# Altium schematic sheet schema2.SchDoc
size A3; DrawnBy: CdB; Engineer: CdB; Organization: Ultimaker B.V.; DocumentNumber: 2; Revision: 1548-I; SheetNumber: 2; SheetTotal: 6; PageSetup: Record=PageOptions|CenterHorizontal=True|CenterVertical=True|PrintScale=1.01|XCorrection=1.00|YCorrection=1.00|PrintKind=1|BorderSize=5000000|LeftOffset=0|BottomOffset=0|Orientation=2|PaperLength=1000|PaperWidth=1000|Scale=100|PaperSource=7|PrintQuality=1200|MediaType=1|DitherType=10|PaperKind=A3 (297 x 420mm)|PrintScaleMode=1
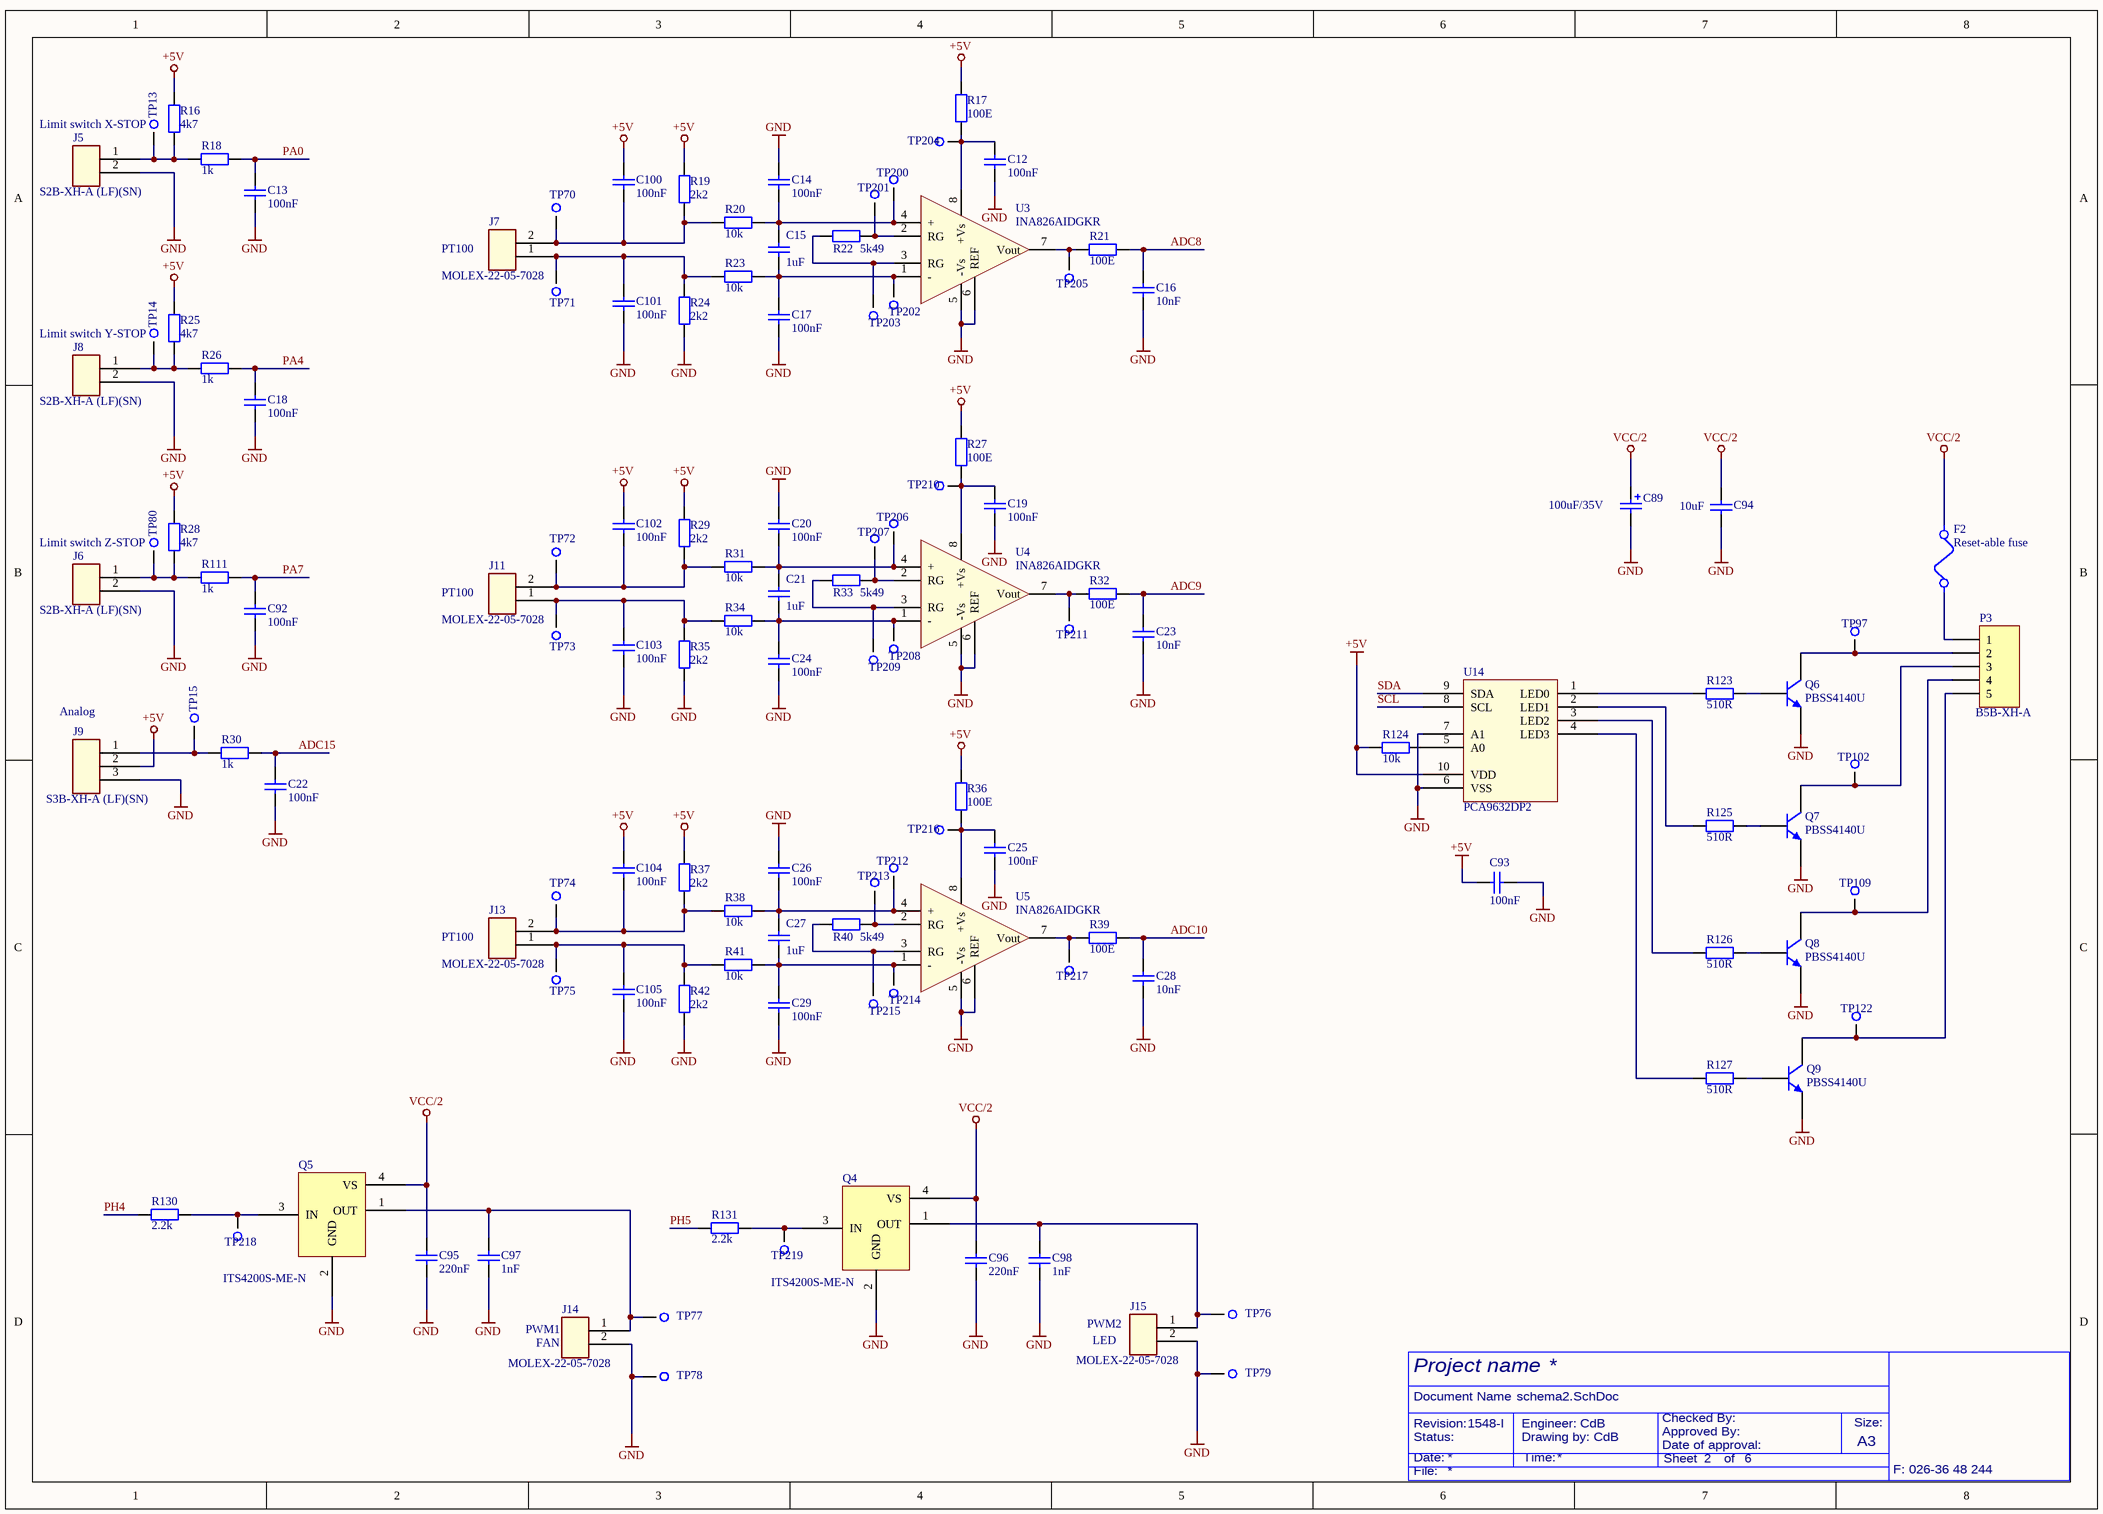
[diagram p0: schema2.SchDoc]

## Parts
C12  100nF  [C0603]
C13  100nF  [C0603]
C14  100nF  [C0603]
C15  1uF  [C0603]
C16  10nF  [C0603]
C17  100nF  [C0603]
C18  100nF  [C0603]
C19  100nF  [C0603]
C20  100nF  [C0603]
C21  1uF  [C0603]
C22  100nF  [C0603]
C23  10nF  [C0603]
C24  100nF  [C0603]
C25  100nF  [C0603]
C26  100nF  [C0603]
C27  1uF  [C0603]
C28  10nF  [C0603]
C29  100nF  [C0603]
C89  100uF/35V  [ELCO Case D]
C92  100nF  [C0603]
C93  100nF  [C0805]
C94  10uF  [C1206]
C95  220nF  [C0805]
C96  220nF  [C0805]
C97  1nF  [C0603]
C98  1nF  [C0603]
C100  100nF  [C0603]
C101  100nF  [C0603]
C102  100nF  [C0603]
C103  100nF  [C0603]
C104  100nF  [C0603]
C105  100nF  [C0603]
F2  Reset-able fuse  [Bourns reset-able fuse]
J5  S2B-XH-A (LF)(SN)  [S2B-XH-A (LF)(SN)]
J6  S2B-XH-A (LF)(SN)  [S2B-XH-A (LF)(SN)]
J7  MOLEX-22-05-7028  [MOLEX-22-05-7028]
J8  S2B-XH-A (LF)(SN)  [S2B-XH-A (LF)(SN)]
J9  S3B-XH-A (LF)(SN)  [S3B-XH-A (LF)(SN)]
J11  MOLEX-22-05-7028  [MOLEX-22-05-7028]
J13  MOLEX-22-05-7028  [MOLEX-22-05-7028]
J14  MOLEX-22-05-7028  [MOLEX-22-05-7028]
J15  MOLEX-22-05-7028  [MOLEX-22-05-7028]
P3  B5B-XH-A  [B5B-XH-A]
Q4  ITS4200S-ME-N  [SOT223 Smartfet]
Q5  ITS4200S-ME-N  [SOT223 Smartfet]
Q6  PBSS4140U  [SOT65P210X110-3N]
Q7  PBSS4140U  [SOT65P210X110-3N]
Q8  PBSS4140U  [SOT65P210X110-3N]
Q9  PBSS4140U  [SOT65P210X110-3N]
R16  4k7  [R0603]
R17  100E  [R0603]
R18  1k  [R0603]
R19  2k2  [R0603]
R20  10k  [R0603]
R21  100E  [R0603]
R22  5k49  [R0603]
R23  10k  [R0603]
R24  2k2  [R0603]
R25  4k7  [R0603]
R26  1k  [R0603]
R27  100E  [R0603]
R28  4k7  [R0603]
R29  2k2  [R0603]
R30  1k  [R0603]
R31  10k  [R0603]
R32  100E  [R0603]
R33  5k49  [R0603]
R34  10k  [R0603]
R35  2k2  [R0603]
R36  100E  [R0603]
R37  2k2  [R0603]
R38  10k  [R0603]
R39  100E  [R0603]
R40  5k49  [R0603]
R41  10k  [R0603]
R42  2k2  [R0603]
R111  1k  [R0603]
R123  510R  [R0603]
R124  10k  [R0603]
R125  510R  [R0603]
R126  510R  [R0603]
R127  510R  [R0603]
R130  2.2k  [RESC1608X05N]
R131  2.2k  [RESC1608X05N]
TP13  Testpoint  [Testpoint]  (value not drawn)
TP14  Testpoint  [Testpoint]  (value not drawn)
TP15  Testpoint  [Testpoint]  (value not drawn)
TP70  Testpoint  [Testpoint]  (value not drawn)
TP71  Testpoint  [Testpoint]  (value not drawn)
TP72  Testpoint  [Testpoint]  (value not drawn)
TP73  Testpoint  [Testpoint]  (value not drawn)
TP74  Testpoint  [Testpoint]  (value not drawn)
TP75  Testpoint  [Testpoint]  (value not drawn)
TP76  Testpoint  [Testpoint]  (value not drawn)
TP77  Testpoint  [Testpoint]  (value not drawn)
TP78  Testpoint  [Testpoint]  (value not drawn)
TP79  Testpoint  [Testpoint]  (value not drawn)
TP80  Testpoint  [Testpoint]  (value not drawn)
TP97  2mm  [TESTPOINT]  (value not drawn)  (no BOM)
TP102  2mm  [TESTPOINT]  (value not drawn)  (no BOM)
TP109  2mm  [TESTPOINT]  (value not drawn)  (no BOM)
TP122  2mm  [TESTPOINT]  (value not drawn)  (no BOM)
TP200  Testpoint 1.6mm  [Testpoint 1.6mm]  (value not drawn)
TP201  Testpoint 1.6mm  [Testpoint 1.6mm]  (value not drawn)
TP202  Testpoint 1.6mm  [Testpoint 1.6mm]  (value not drawn)
TP203  Testpoint 1.6mm  [Testpoint 1.6mm]  (value not drawn)
TP204  Testpoint 1.6mm  [Testpoint 1.6mm]  (value not drawn)
TP205  Testpoint 1.6mm  [Testpoint 1.6mm]  (value not drawn)
TP206  Testpoint 1.6mm  [Testpoint 1.6mm]  (value not drawn)
TP207  Testpoint 1.6mm  [Testpoint 1.6mm]  (value not drawn)
TP208  Testpoint 1.6mm  [Testpoint 1.6mm]  (value not drawn)
TP209  Testpoint 1.6mm  [Testpoint 1.6mm]  (value not drawn)
TP210  Testpoint 1.6mm  [Testpoint 1.6mm]  (value not drawn)
TP211  Testpoint 1.6mm  [Testpoint 1.6mm]  (value not drawn)
TP212  Testpoint 1.6mm  [Testpoint 1.6mm]  (value not drawn)
TP213  Testpoint 1.6mm  [Testpoint 1.6mm]  (value not drawn)
TP214  Testpoint 1.6mm  [Testpoint 1.6mm]  (value not drawn)
TP215  Testpoint 1.6mm  [Testpoint 1.6mm]  (value not drawn)
TP216  Testpoint 1.6mm  [Testpoint 1.6mm]  (value not drawn)
TP217  Testpoint 1.6mm  [Testpoint 1.6mm]  (value not drawn)
TP218  Testpoint 1.6mm  [Testpoint 1.6mm]  (value not drawn)
TP219  Testpoint 1.6mm  [Testpoint 1.6mm]  (value not drawn)
U3  INA826AIDGKR  [TSOP65P490X110-8N (MSOP8)]
U4  INA826AIDGKR  [TSOP65P490X110-8N (MSOP8)]
U5  INA826AIDGKR  [TSOP65P490X110-8N (MSOP8)]
U14  PCA9632DP2  [IC TSSOP-10]

## Nets
+5V: C93.1 C100.2 C102.2 C104.2 J9.2 R16.2 R17.1 R19.1 R25.2 R27.1 R28.2 R29.1 R36.1 R37.1 R124.2 U14.10(VDD)
GND: C12.1 C13.1 C14.2 C16.1 C17.1 C18.1 C19.1 C20.2 C22.1 C23.1 C24.1 C25.1 C26.2 C28.1 C29.1 C89.2 C92.1 C93.2 C94.1 C95.1 C96.1 C97.1 C98.1 C101.1 C103.1 C105.1 J5.2 J6.2 J8.2 J9.3 J14.2 J15.2 Q4.2(GND) Q5.2(GND) Q6.2(E) Q7.2(E) Q8.2(E) Q9.2(E) R24.1 R35.1 R42.1 TP78.1 TP79.1 U3.5(-Vs) U3.6(REF) U4.5(-Vs) U4.6(REF) U5.5(-Vs) U5.6(REF) U14.6(VSS) U14.7(A1)
VCC/2: C89.1 C94.2 C95.2 C96.2 F2.2 Q4.4(VS) Q5.4(VS)
ADC8: C16.2 R21.2
ADC9: C23.2 R32.2
ADC10: C28.2 R39.2
ADC15: C22.2 R30.2
PA0: C13.2 R18.2
PA4: C18.2 R26.2
PA7: C92.2 R111.2
PH4: R130.2
PH5: R131.2
SCL: U14.8(SCL)
SDA: U14.9(SDA)
NetC12_2: C12.2 R17.2 TP204.1 U3.8(+Vs)
NetC14_1: C14.1 C15.2 R20.2 TP200.1 U3.4(+)
NetC15_1: C15.1 C17.2 R23.2 TP202.1 U3.1(-)
NetC19_2: C19.2 R27.2 TP210.1 U4.8(+Vs)
NetC20_1: C20.1 C21.2 R31.2 TP206.1 U4.4(+)
NetC21_1: C21.1 C24.2 R34.2 TP208.1 U4.1(-)
NetC25_2: C25.2 R36.2 TP216.1 U5.8(+Vs)
NetC26_1: C26.1 C27.2 R38.2 TP212.1 U5.4(+)
NetC27_1: C27.1 C29.2 R41.2 TP214.1 U5.1(-)
NetC97_2: C97.2 J14.1 Q5.1(OUT) TP77.1
NetC98_2: C98.2 J15.1 Q4.1(OUT) TP76.1
NetC100_1: C100.1 J7.2 R19.2 R20.1 TP70.1
NetC101_2: C101.2 J7.1 R23.1 R24.2 TP71.1
NetC102_1: C102.1 J11.2 R29.2 R31.1 TP72.1
NetC103_2: C103.2 J11.1 R34.1 R35.2 TP73.1
NetC104_1: C104.1 J13.2 R37.2 R38.1 TP74.1
NetC105_2: C105.2 J13.1 R41.1 R42.2 TP75.1
NetF2_1: F2.1 P3.1
NetJ5_1: J5.1 R16.1 R18.1 TP13.1
NetJ6_1: J6.1 R28.1 R111.1 TP80.1
NetJ8_1: J8.1 R25.1 R26.1 TP14.1
NetJ9_1: J9.1 R30.1 TP15.1
NetP3_2: P3.2 Q6.3(C) TP97.1
NetP3_3: P3.3 Q7.3(C) TP102.1
NetP3_4: P3.4 Q8.3(C) TP109.1
NetP3_5: P3.5 Q9.3(C) TP122.1
NetQ4_3: Q4.3(IN) R131.1 TP219.1
NetQ5_3: Q5.3(IN) R130.1 TP218.1
NetQ6_1: Q6.1(B) R123.1
NetQ7_1: Q7.1(B) R125.1
NetQ8_1: Q8.1(B) R126.1
NetQ9_1: Q9.1(B) R127.1
NetR21_1: R21.1 TP205.1 U3.7(Vout)
NetR22_1: R22.1 TP201.1 U3.2(RG)
NetR22_2: R22.2 TP203.1 U3.3(RG)
NetR32_1: R32.1 TP211.1 U4.7(Vout)
NetR33_1: R33.1 TP207.1 U4.2(RG)
NetR33_2: R33.2 TP209.1 U4.3(RG)
NetR39_1: R39.1 TP217.1 U5.7(Vout)
NetR40_1: R40.1 TP213.1 U5.2(RG)
NetR40_2: R40.2 TP215.1 U5.3(RG)
NetR123_2: R123.2 U14.1(LED0)
NetR124_1: R124.1 U14.5(A0)
NetR125_2: R125.2 U14.2(LED1)
NetR126_2: R126.2 U14.3(LED2)
NetR127_2: R127.2 U14.4(LED3)

## Notes on the sheet
- (near TP13) Limit switch X-STOP
- (near J7) PT100
- (near TP14) Limit switch Y-STOP
- (near TP80) Limit switch Z-STOP
- (near J11) PT100
- (near J9) Analog
- (near J13) PT100
- (near J14) PWM1
- PWM2
- (near J14) FAN
- (near J15) LED
- Project name
- Document Name
- Revision:
- Date:
- Status:
- Engineer:
- Drawing by:
- Time:
- Approved By:
- Checked By:
- Date of approval:
- Sheet
- of
- Size:
- A3
- File:
- F: 026-36 48 244

## Library data of the parts
C12-C14 C17-C20 C22 C24-C26 C29 C92 C100-C105 = Library_CAP-0002: RO X7R 100nF 10% 50V 0603; Faber ItemCode: 45068500; ID: Library_CAP-0002; Value: 100nF
C15 C21 C27 = Library_CAP-0006: RO X5R 1uF 10% 10V 0603; Faber ItemCode: 36310600; ID: Library_CAP-0006; Value: 1uF
C16 C23 C28 = Library_CAP-0007: RO X7R 10nF 10% 50V 0603; Faber ItemCode: 36270400; ID: Library_CAP-0007; Value: 10nF
C89 = Library_CAP-0004: RO ELCO 100uF 20% 35V CASE-D EEEFP PAN; Faber ItemCode: 36865800; ID: Library_CAP-0004; Value: 100uF/35V
C93 = Cap 100nF X7R 0805: Cap 100nF X7R 0805 10% 100V; Mfg: AVX; Mfg code: 08051C104K4T2A; Faber ItemCode: -; Max soldering temp: -; Remarks: -; Supplier: Farnell; Supplier code: 1833888; Value: 100nF; SMD: Yes
C94 = Library_CAP-0005: RO X5R 10UF 10% 35V 1206; Faber ItemCode: 35436800; ID: Library_CAP-0005; Value: 10uF
C95 C96 = Cap: Capacitor, C Series, 0.22 µF, ± 10%, X7R, 50 V, 0805 [2012 Metric]; Mfg: KEMET; Mfg code: C0805C224K5RACTU; Value: 220nF
C97 C98 = Library_CAP-0002: CAP X7R 1nF 10% 50V 0603; Mfg: WALSIN; Mfg code: 0603B102K500CT; Value: 1nF
F2 = Library_FUSE-0001: Mfg: Bourns; Mfg code: MF-SM075-2
J5 J6 J8 = Library_CON-0004: RO CONN PR 2p HKS S2B-XH-A (LF)(SN) JST; Mfg: JST (JAPAN SOLDERLESS TERMINALS); Faber ItemCode: 36926700; ID: Library_CON-0004; Mfg code: S2B-XH-A (LF)(SN); Value: S2B-XH-A (LF)(SN)
J7 J11 J13-J15 = Library_CON-0006: RO CONN PR 2p HKS 22-05-7028 MOLEX; Info: 2.54mm Pitch KK® Wire-to-Board Header, Right Angle, with Friction Lock, 2 Circuits; Faber ItemCode: 36926400; Mfg: MOLEX; Mfg code: 22-05-7028; ID: Library_CON-0006; Value: MOLEX-22-05-7028
J9 = Library_CON-0020: RO CONN PR 3p HKS S3B-XH-A (LF)(SN) JST; Faber ItemCode: 36948200; Mfg: JST (JAPAN SOLDERLESS TERMINALS); ID: Library_CON-0020; Mfg code: S3B-XH-A (LF)(SN); Value: S3B-XH-A (LF)(SN)
P3 = Header 5: Header, 5-Pin; Mfg: JST (JAPAN SOLDERLESS TERMINALS); Mfg code: B5B-XH-A (LF)(SN); LatestRevisionDate: 17-Jul-2002; LatestRevisionNote: Re-released for DXP Platform.; Publisher: Altium Limited; Farnell code: 1516281
Q4 Q5 = MOSFET-N met GND: Infeneon ITS4200S-ME-N; Mfg: Infineon; Mfg code: ITS4200S-ME-N
Q6-Q9 = NPN PBSS4140U: NPN PBSS4140U SOT-323 1A; Mfg: NXP; Faber ItemCode: -; Max soldering temp: -; Mfg code: PBSS4140U; Remarks: -; Supplier: Farnell; Supplier code: 8736197; Value: -; SMD: Yes
R16 R25 R28 = Library_RES-0002: RO RES 4k70 1% 0,063W  0603; Faber ItemCode: 36257400; ID: Library_RES-0002; Info: Resistor; Value: 4k7
R17 R21 R27 R32 R36 R39 = Library_RES-0006: RO RES 100E 1% 0,063W  0603; Faber ItemCode: 32338800; ID: Library_RES-0006; Info: Resistor; Value: 100E
R18 R26 R30 R111 = Library_RES-0004: RO RES 1k0 1% 0,1W  0603; Faber ItemCode: 34637900; ID: Library_RES-0004; Info: Resistor; Value: 1k
R19 R24 R29 R35 R37 R42 = Library_RES-0010: RO RES 2k2 0,1% 0,063W 25ppm 0603; Mfg: TE CONNECTIVITY / NEOHM; Mfg code: CPF0603B2K2E1; Faber ItemCode: 36926600; ID: Library_RES-0010; Info: Resistor; Value: 2k2
R20 R23 R31 R34 R38 R41 R124 = Library_RES-0001: RO RES 10k0 1% 0,063W  0603; Faber ItemCode: 36084500; ID: Library_RES-0001; Info: Resistor; Value: 10k
R22 R33 R40 = Library_RES-0011: RO RES 5K49 0,1% 0,063W 25ppm 0603; Mfg: WELWYN; Mfg code: PCF0603R 5K49B.T1; Faber ItemCode: 36926200; ID: Library_RES-0011; Info: Resistor; Value: 5k49
R123 R125-R127 = Library_RES-0001: RO RES 510R 1% 0,063W  0603; Mfg: MULTICOMP; Mfg code: MC0063W06031619R; Info: Resistor; Value: 510R; Farnell code: 2130839
R130 R131 = 2.2k/0603: RES 2.20K OHM 1/10W 1% 0603 SMD; Manufacturer: Vishay Dale; Manufacturer Part Number: CRCW06032K20FKEA; Power (Watts): 0.1W, 1/10W; Temperature Coefficient: ±100ppm/°C; Info: Resistor; VALUE: 2.2k; Supplier 1: Digi-Key; RoHS: RoHS Compliant; Category: Resistors; Stock 1: 117350; Pricing 1: 10=0.069, 50=0.037, 200=0.02135, 1000=0.01454 (EUR); Resistance (Ohms): 2.2k; Composition: Thick Film; Features: Automotive AEC-Q200 Qualified; Tolerance: ±1%; Package / Case: 0603 (1608 Metric); Supplier Device Package: 0603 (1608 Metric); Size / Dimension: 0.061" L x 0.033" W (1.55mm x 0.85mm); Height: 0.020" (0.50mm); Number of Terminations: 2; Packaging: Digi-Reel®; ComponentLink1URL: http://www.vishay.com/doc?20035; ComponentLink1Description: http://www.vishay.com/doc?20035; Supplier Part Number 1: 541-2.20KHDKR-ND; Mfg: Vishay Dale; Mfg code: CRCW06032K20FKEA
TP13-TP15 TP70-TP80 = Library_MISC-0001: Info: Testpoint, 2mm, round; ID: Library_MISC-0001; Faber ItemCode: -; Mfg: -; Mfg code: -; Value: Testpoint
TP97 TP102 TP109 TP122 = Testpoint, 2mm, round: Remarks: Not a component; Faber ItemCode: -; Mfg: -; Mfg code: -; Value: -; Supplier: -; Supplier code: -; Max soldering temp: -
TP200-TP219 = Testpoint 1.6mm: ID: Library_MISC-0001; Faber ItemCode: -; Mfg: -; Mfg code: -; Info: Testpoint 1.6mm; Value: Testpoint 1.6mm
U3-U5 = Library_ICS-0003: RO IC INA826AIDGKR MSOP-8 TI; Mfg: Texas Instruments; Info: Precision, 200-µA Supply Current, 2.7-V to 36-V Supply Instrumentation Amplifier with Rail-to-Rail Output; Faber ItemCode: 36926300; Mfg code: INA826AIDGKR; ID: Library_ICS-0003; Value: INA826AIDGKR
U14 = IC PCA9632: IC LED DRIVER RGBA; Faber ItemCode: 36966800; Mfg: NXP; Faber Artikelomschrijving: IC PCA9632DP2 TSSOP-10 NXP; Bestel grote: 1000; Prijs: 1,0876; Max soldering temp: -; Mfg code: PCA9632DP2; Remarks: -; SMD: Yes; Supplier: Digikey; Supplier code: 568-8254-6-ND; Value: -